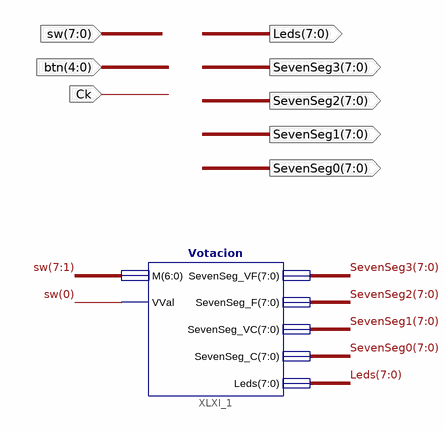
[diagram p0: schematic sheet 1]
// Xilinx ISE schematic MyDesign.sch (spartan6) as structural Verilog: 1 symbols, 8 ports
module MyDesign (
  input  [7:0] sw,
  input  [4:0] btn,
  input  Ck,
  output [7:0] Leds,
  output [7:0] SevenSeg3,
  output [7:0] SevenSeg2,
  output [7:0] SevenSeg1,
  output [7:0] SevenSeg0
);

  Votacion XLXI_1 (
    .Leds(Leds), .M(sw[7:1]), .SevenSeg_C(SevenSeg0), .SevenSeg_F(SevenSeg2), .SevenSeg_VC(SevenSeg1),
    .SevenSeg_VF(SevenSeg3), .VVal(sw[0]));
endmodule
